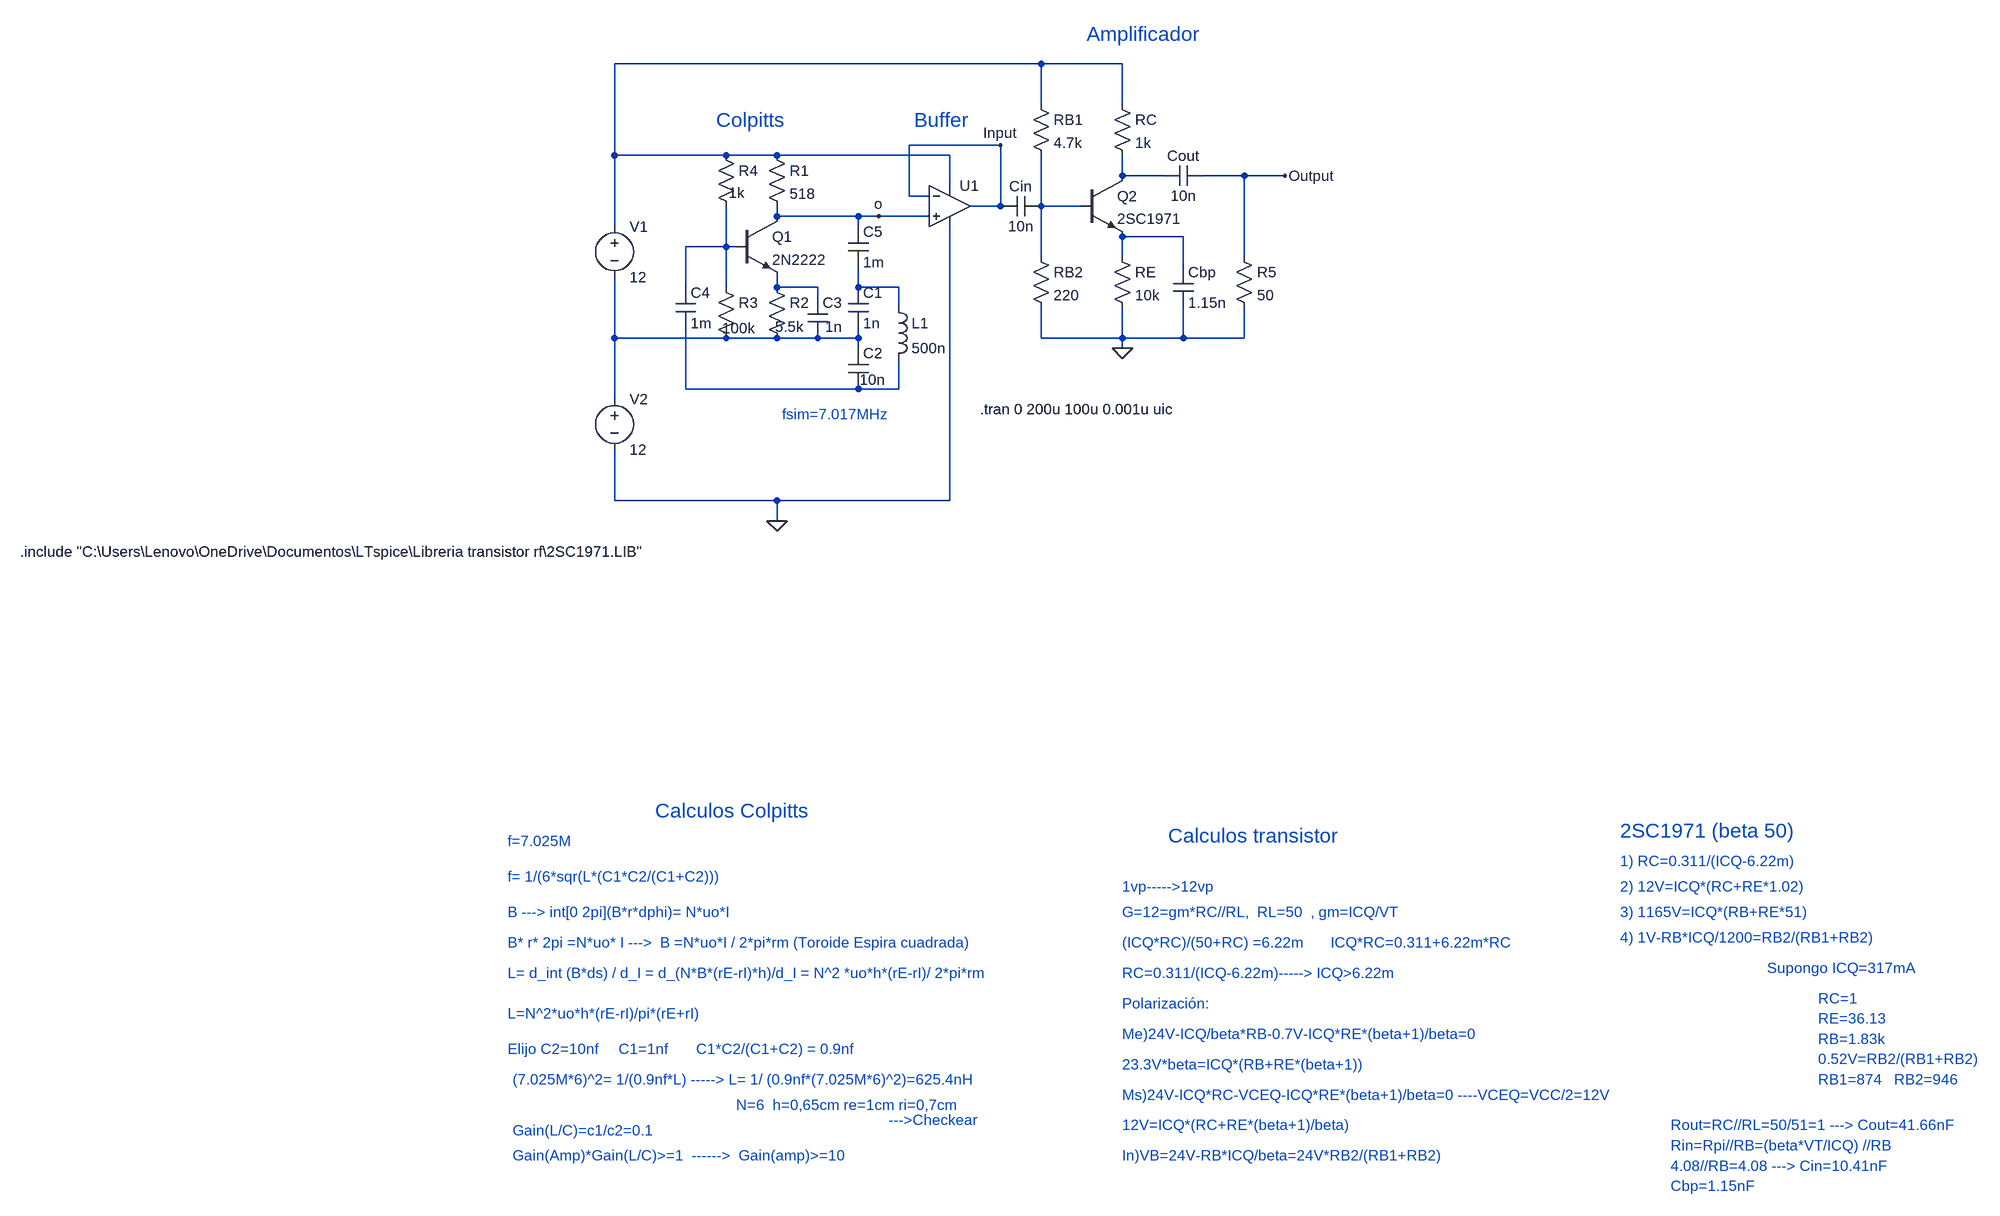
[diagram p0: schematic Transmisor Morse.asc]
Transmisor Morse.asc, the LTspice schematic file:
Version 4
SHEET 1 2728 1688
WIRE 608 -144 -64 -144
WIRE 736 -144 608 -144
WIRE 608 -80 608 -144
WIRE 736 -80 736 -144
WIRE 544 -16 400 -16
WIRE -64 0 -64 -144
WIRE 112 0 -64 0
WIRE 192 0 112 0
WIRE 464 0 192 0
WIRE 736 32 736 0
WIRE 800 32 736 32
WIRE 928 32 864 32
WIRE 992 32 928 32
WIRE 464 48 464 0
WIRE 400 64 400 -16
WIRE 432 64 400 64
WIRE 544 80 544 -16
WIRE 544 80 496 80
WIRE 608 80 608 0
WIRE 672 80 608 80
WIRE 192 96 192 80
WIRE 320 96 192 96
WIRE 352 96 320 96
WIRE 432 96 352 96
WIRE -64 112 -64 0
WIRE 320 112 320 96
WIRE 832 128 736 128
WIRE 112 144 112 80
WIRE 112 144 48 144
WIRE 128 144 112 144
WIRE 608 160 608 80
WIRE 736 160 736 128
WIRE 928 160 928 32
WIRE 832 176 832 128
WIRE 48 208 48 144
WIRE 112 208 112 144
WIRE 192 208 192 192
WIRE 256 208 192 208
WIRE 320 208 320 176
WIRE 384 208 320 208
WIRE 256 224 256 208
WIRE 384 240 384 208
WIRE -64 288 -64 192
WIRE 112 288 -64 288
WIRE 192 288 112 288
WIRE 256 288 192 288
WIRE 320 288 320 272
WIRE 320 288 256 288
WIRE 608 288 608 240
WIRE 736 288 736 240
WIRE 736 288 608 288
WIRE 832 288 832 240
WIRE 832 288 736 288
WIRE 928 288 928 240
WIRE 928 288 832 288
WIRE 320 304 320 288
WIRE 736 304 736 288
WIRE 48 368 48 272
WIRE 320 368 48 368
WIRE 384 368 384 320
WIRE 384 368 320 368
WIRE -64 384 -64 288
WIRE -64 544 -64 464
WIRE 192 544 -64 544
WIRE 464 544 464 112
WIRE 464 544 192 544
WIRE 192 576 192 544
FLAG 352 96 o
FLAG 992 32 Output
FLAG 736 304 0
FLAG 544 -16 Input
FLAG 192 576 0
SYMBOL npn 128 96 R0
SYMATTR InstName Q1
SYMATTR Value 2N2222
SYMBOL voltage -64 96 R0
WINDOW 123 0 0 Left 0
WINDOW 39 0 0 Left 0
SYMATTR InstName V1
SYMATTR Value 12
SYMBOL res 176 -16 R0
SYMATTR InstName R1
SYMATTR Value 518
SYMBOL res 176 192 R0
WINDOW 3 13 78 Left 2
SYMATTR Value 5.5k
SYMATTR InstName R2
SYMBOL res 96 192 R0
WINDOW 3 10 80 Left 2
SYMATTR Value 100k
SYMATTR InstName R3
SYMBOL res 96 -16 R0
WINDOW 3 20 75 Left 2
SYMATTR Value 1k
SYMATTR InstName R4
SYMBOL cap 304 304 R0
WINDOW 3 18 49 Left 2
SYMATTR Value 10n
SYMATTR InstName C2
SYMBOL cap 304 208 R0
SYMATTR InstName C1
SYMATTR Value 1n
SYMBOL ind 368 224 R0
SYMATTR InstName L1
SYMATTR Value 500n
SYMBOL cap 240 224 R0
WINDOW 3 28 46 Left 2
SYMATTR Value 1n
SYMATTR InstName C3
SYMBOL cap 32 208 R0
SYMATTR InstName C4
SYMATTR Value 1m
SYMBOL cap 304 112 R0
SYMATTR InstName C5
SYMATTR Value 1m
SYMBOL voltage -64 368 R0
SYMATTR InstName V2
SYMATTR Value 12
SYMBOL res 592 -96 R0
SYMATTR InstName RB1
SYMATTR Value 4.7k
SYMBOL res 720 -96 R0
SYMATTR InstName RC
SYMATTR Value 1k
SYMBOL res 720 144 R0
SYMATTR InstName RE
SYMATTR Value 10k
SYMBOL res 592 144 R0
SYMATTR InstName RB2
SYMATTR Value 220
SYMBOL cap 816 176 R0
SYMATTR InstName Cbp
SYMATTR Value 1.15n
SYMBOL npn 672 32 R0
SYMATTR InstName Q2
SYMATTR Value 2SC1971
SYMBOL OpAmps\\UniversalOpAmp1 464 80 R0
SYMATTR InstName U1
SYMATTR Value2 Avol=1Meg GBW=100Meg Vos=0
SYMBOL res 912 144 R0
SYMATTR InstName R5
SYMATTR Value 50
SYMBOL cap 864 16 R90
WINDOW 0 0 32 VBottom 2
WINDOW 3 32 32 VTop 2
SYMATTR InstName Cout
SYMATTR Value 10n
SYMBOL cap 608 64 R90
WINDOW 0 0 32 VBottom 2
WINDOW 3 32 32 VTop 2
SYMATTR InstName Cin
SYMATTR Value 10n
TEXT -232 1080 Left 2 ;f=7.025M
TEXT -232 1136 Left 2 ;f= 1/(6*sqr(L*(C1*C2/(C1+C2)))
TEXT -232 1192 Left 2 ;B ---> int[0 2pi](B*r*dphi)= N*uo*I
TEXT -232 1240 Left 2 ;B* r* 2pi =N*uo* I --->  B =N*uo*I / 2*pi*rm (Toroide Espira cuadrada)
TEXT -232 1288 Left 2 ;L= d_int (B*ds) / d_I = d_(N*B*(rE-rI)*h)/d_I = N^2 *uo*h*(rE-rI)/ 2*pi*rm
TEXT -232 1352 Left 2 ;L=N^2*uo*h*(rE-rI)/pi*(rE+rI)
TEXT -232 1408 Left 2 ;Elijo C2=10nf     C1=1nf       C1*C2/(C1+C2) = 0.9nf
TEXT -224 1456 Left 2 ;(7.025M*6)^2= 1/(0.9nf*L) -----> L= 1/ (0.9nf*(7.025M*6)^2)=625.4nH
TEXT 128 1496 Left 2 ;N=6  h=0,65cm re=1cm ri=0,7cm
TEXT 512 400 Left 2 !.tran 0 200u 100u 0.001u uic
TEXT -224 1536 Left 2 ;Gain(L/C)=c1/c2=0.1
TEXT -224 1576 Left 2 ;Gain(Amp)*Gain(L/C)>=1  ------>  Gain(amp)>=10
TEXT -1000 624 Left 2 !.include "C:\\Users\\Lenovo\\OneDrive\\Documentos\\LTspice\\Libreria transistor rf\\2SC1971.LIB"
TEXT 96 -56 Left 3 ;Colpitts
TEXT 408 -56 Left 3 ;Buffer
TEXT 0 1032 Left 3 ;Calculos Colpitts
TEXT 736 1152 Left 2 ;1vp----->12vp
TEXT 736 1192 Left 2 ;G=12=gm*RC//RL,  RL=50  , gm=ICQ/VT
TEXT 736 1240 Left 2 ;(ICQ*RC)/(50+RC) =6.22m
TEXT 1064 1240 Left 2 ;ICQ*RC=0.311+6.22m*RC
TEXT 736 1288 Left 2 ;RC=0.311/(ICQ-6.22m)-----> ICQ>6.22m
TEXT 736 1336 Left 2 ;Polarización:
TEXT 736 1384 Left 2 ;Me)24V-ICQ/beta*RB-0.7V-ICQ*RE*(beta+1)/beta=0
TEXT 736 1432 Left 2 ;23.3V*beta=ICQ*(RB+RE*(beta+1))
TEXT 736 1480 Left 2 ;Ms)24V-ICQ*RC-VCEQ-ICQ*RE*(beta+1)/beta=0 ----VCEQ=VCC/2=12V
TEXT 736 1528 Left 2 ;12V=ICQ*(RC+RE*(beta+1)/beta)
TEXT 736 1576 Left 2 ;In)VB=24V-RB*ICQ/beta=24V*RB2/(RB1+RB2)
TEXT 808 1072 Left 3 ;Calculos transistor
TEXT 1520 1064 Left 3 ;2SC1971 (beta 50)
TEXT 1520 1192 Left 2 ;3) 1165V=ICQ*(RB+RE*51)
TEXT 1520 1152 Left 2 ;2) 12V=ICQ*(RC+RE*1.02)
TEXT 1520 1232 Left 2 ;4) 1V-RB*ICQ/1200=RB2/(RB1+RB2)
TEXT 1520 1112 Left 2 ;1) RC=0.311/(ICQ-6.22m)
TEXT 1752 1280 Left 2 ;Supongo ICQ=317mA
TEXT 1832 1328 Left 2 ;RC=1
TEXT 1832 1360 Left 2 ;RE=36.13
TEXT 1832 1392 Left 2 ;RB=1.83k
TEXT 1832 1424 Left 2 ;0.52V=RB2/(RB1+RB2)
TEXT 1832 1456 Left 2 ;RB1=874   RB2=946
TEXT 680 -192 Left 3 ;Amplificador
TEXT 1600 1528 Left 2 ;Rout=RC//RL=50/51=1 ---> Cout=41.66nF
TEXT 1600 1560 Left 2 ;Rin=Rpi//RB=(beta*VT/ICQ) //RB
TEXT 1600 1624 Left 2 ;Cbp=1.15nF
TEXT 368 1520 Left 2 ;--->Checkear
TEXT 1600 1592 Left 2 ;4.08//RB=4.08 ---> Cin=10.41nF
TEXT 200 408 Left 2 ;fsim=7.017MHz

The netlist it stands for:
* Transmisor Morse.asc
Q1 o N005 N006 0 2N2222
V1 N001 N008 12
R1 N001 o 518
R2 N006 N008 5.5k
R3 N005 N008 100k
R4 N001 N005 1k
C2 N008 N009 10n
C1 N007 N008 1n
L1 N007 N009 500n
C3 N006 N008 1n
C4 N005 N009 1m
C5 o N007 1m
V2 N008 0 12
RB1 N001 N003 4.7k
RC N001 N002 1k
RE N004 0 10k
RB2 N003 0 220
Cbp N004 0 1.15n
Q2 N002 N003 N004 0 2SC1971
XU1 o Input N001 0 Input level1 Avol=1Meg GBW=100Meg Vos=0 En=0 Enk=0 In=0 Ink=0 Rin=500Meg  ; pins In+ In- V+ V- OUT
R5 Output 0 50
Cout Output N002 10n
Cin N003 Input 10n
.model NPN NPN
.model PNP PNP
.lib standard.bjt
* f=7.025M
* f= 1/(6*sqr(L*(C1*C2/(C1+C2)))
* B ---> int[0 2pi](B*r*dphi)= N*uo*I
* B* r* 2pi =N*uo* I --->  B =N*uo*I / 2*pi*rm (Toroide Espira cuadrada)
* L= d_int (B*ds) / d_I = d_(N*B*(rE-rI)*h)/d_I = N^2 *uo*h*(rE-rI)/ 2*pi*rm
* L=N^2*uo*h*(rE-rI)/pi*(rE+rI)
* Elijo C2=10nf     C1=1nf       C1*C2/(C1+C2) = 0.9nf
* (7.025M*6)^2= 1/(0.9nf*L) -----> L= 1/ (0.9nf*(7.025M*6)^2)=625.4nH
* N=6  h=0,65cm re=1cm ri=0,7cm
.tran 0 200u 100u 0.001u uic
* Gain(L/C)=c1/c2=0.1
* Gain(Amp)*Gain(L/C)>=1  ------>  Gain(amp)>=10
.include "C:\Users\Lenovo\OneDrive\Documentos\LTspice\Libreria transistor rf\2SC1971.LIB"
* Colpitts
* Buffer
* Calculos Colpitts
* 1vp----->12vp
* G=12=gm*RC//RL,  RL=50  , gm=ICQ/VT
* (ICQ*RC)/(50+RC) =6.22m
* ICQ*RC=0.311+6.22m*RC
* RC=0.311/(ICQ-6.22m)-----> ICQ>6.22m
* Polarización:
* Me)24V-ICQ/beta*RB-0.7V-ICQ*RE*(beta+1)/beta=0
* 23.3V*beta=ICQ*(RB+RE*(beta+1))
* Ms)24V-ICQ*RC-VCEQ-ICQ*RE*(beta+1)/beta=0 ----VCEQ=VCC/2=12V
* 12V=ICQ*(RC+RE*(beta+1)/beta)
* In)VB=24V-RB*ICQ/beta=24V*RB2/(RB1+RB2)
* Calculos transistor
* 2SC1971 (beta 50)
* 3) 1165V=ICQ*(RB+RE*51)
* 2) 12V=ICQ*(RC+RE*1.02)
* 4) 1V-RB*ICQ/1200=RB2/(RB1+RB2)
* 1) RC=0.311/(ICQ-6.22m)
* Supongo ICQ=317mA
* RC=1
* RE=36.13
* RB=1.83k
* 0.52V=RB2/(RB1+RB2)
* RB1=874   RB2=946
* Amplificador
* Rout=RC//RL=50/51=1 ---> Cout=41.66nF
* Rin=Rpi//RB=(beta*VT/ICQ) //RB
* Cbp=1.15nF
* --->Checkear
* 4.08//RB=4.08 ---> Cin=10.41nF
* fsim=7.017MHz
.lib UniversalOpAmp1.lib
.backanno
.end